# Altium schematic sheet 5V - 3.3V regulator.SchDoc
size A4
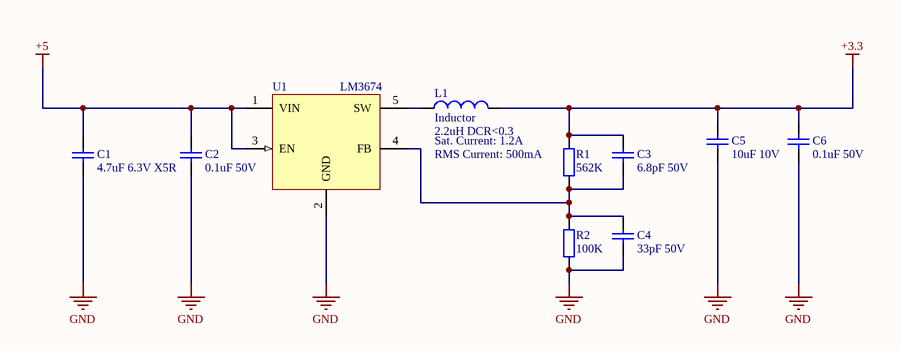
[diagram p0: 5V - 3.3V regulator.SchDoc]

## Parts
C1  value 4.7uF 6.3V X5R  (hidden comment: Cap)
C2  value 0.1uF 50V  (hidden comment: Cap)
C3  value 6.8pF 50V  (hidden comment: Cap)
C4  value 33pF 50V  (hidden comment: Cap)
C5  value 10uF 10V  (hidden comment: Cap)
C6  value 0.1uF 50V  (hidden comment: Cap)
L1  Inductor  value 2.2uH DCR<0.3  Sat. Current: 1.2A  RMS Current: 500mA  [B82422H1222K]
R1  value 562K  [MC0603]  (hidden comment: Res)
R2  value 100K  [MC0603]  (hidden comment: Res)
U1  LM3674  [LM3674MF-ADJ]

## Nets
+3.3: C3.2 C5.2 C6.2 L1.2 R1.2
+5: C1.2 C2.2 U1.1(VIN) U1.3(EN)
GND: C1.1 C2.1 C4.1 C5.1 C6.1 R2.1 U1.2(GND)
NetC3_1: C3.1 C4.2 R1.1 R2.2 U1.4(FB)
NetL1_1: L1.1 U1.5(SW)

## Library data of the parts
C1-C6 = Cap: Capacitor
  C1: farnell: 1414664
  C3: farnell: 1800810
  C4: farnell: 1414685
  C5: farnell: 1463362
R1 R2 = Res2: Resistor
  R1: farnell: 1171061
  R2: farnell: 9330402
U1 = LM3674: 5V STEP DOWN CONV, 600MA, POWERWISE; farnell: 1312587
L1 = Inductor: PackageDescription: Chip Inductor; farnell: 1299971